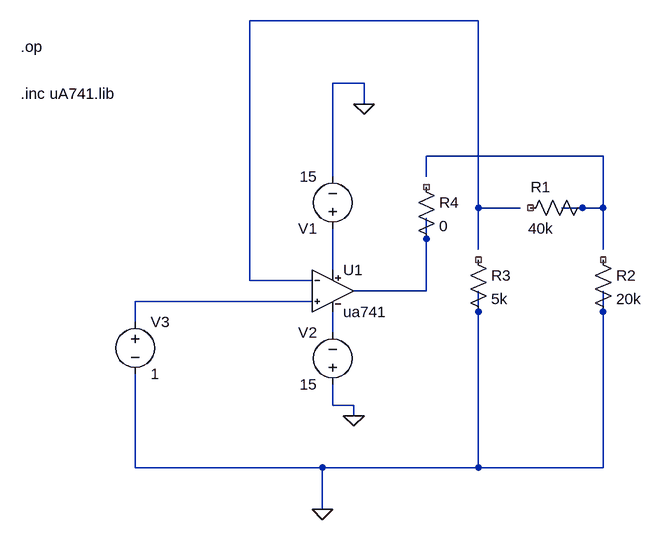
[diagram p0: schematic Prac_05_11.asc]
Prac_05_11.asc, the LTspice schematic file:
Version 4.1
SHEET 1 880 680
WIRE 432 -304 80 -304
WIRE 256 -208 208 -208
WIRE 256 -176 256 -208
WIRE 624 -96 352 -96
WIRE 208 -64 208 -208
WIRE 352 -64 352 -96
WIRE 432 -16 432 -304
WIRE 496 -16 432 -16
WIRE 624 -16 624 -96
WIRE 624 -16 560 -16
WIRE 432 48 432 -16
WIRE 624 48 624 -16
WIRE 208 80 208 16
WIRE 80 96 80 -304
WIRE 176 96 80 96
WIRE 352 112 352 0
WIRE 352 112 240 112
WIRE 176 128 -96 128
WIRE -96 160 -96 128
WIRE 208 176 208 144
WIRE 208 288 208 256
WIRE 240 288 208 288
WIRE 240 304 240 288
WIRE -96 384 -96 240
WIRE 192 384 -96 384
WIRE 432 384 432 112
WIRE 432 384 192 384
WIRE 624 384 624 112
WIRE 624 384 432 384
WIRE 192 448 192 384
FLAG 256 -176 0
FLAG 240 304 0
FLAG 192 448 0
SYMBOL OpAmps\\ua741 208 48 R0
SYMATTR InstName U1
SYMBOL voltage 208 32 R180
WINDOW 123 0 0 Left 0
WINDOW 39 0 0 Left 0
SYMATTR InstName V1
SYMATTR Value 15
SYMBOL voltage 208 272 R180
WINDOW 0 24 96 Left 2
WINDOW 3 24 16 Left 2
SYMATTR InstName V2
SYMATTR Value 15
SYMBOL voltage -96 144 R0
WINDOW 123 0 0 Left 0
WINDOW 39 0 0 Left 0
SYMATTR InstName V3
SYMATTR Value 1
SYMBOL res 496 0 R270
WINDOW 0 32 32 VTop 2
WINDOW 3 0 32 VBottom 2
SYMATTR InstName R1
SYMATTR Value 40k
SYMBOL res 608 48 R0
SYMATTR InstName R2
SYMATTR Value 20k
SYMBOL res 416 48 R0
SYMATTR InstName R3
SYMATTR Value 5k
SYMBOL res 336 -64 R0
SYMATTR InstName R4
SYMATTR Value 0
TEXT -272 -264 Left 2 !.op
TEXT -272 -192 Left 2 !.inc uA741.lib

The netlist it stands for:
* Prac_05_11.asc
X§U1 N005 N001 N003 N006 N004 ua741  ; pins In+ In- V+ V- OUT
V1 N003 0 15
V2 0 N006 15
V3 N005 0 1
R1 NC_01 N002 40k
R2 NC_02 0 20k
R3 NC_03 0 5k
R4 NC_04 N004 0
.op
.inc uA741.lib
.backanno
.end